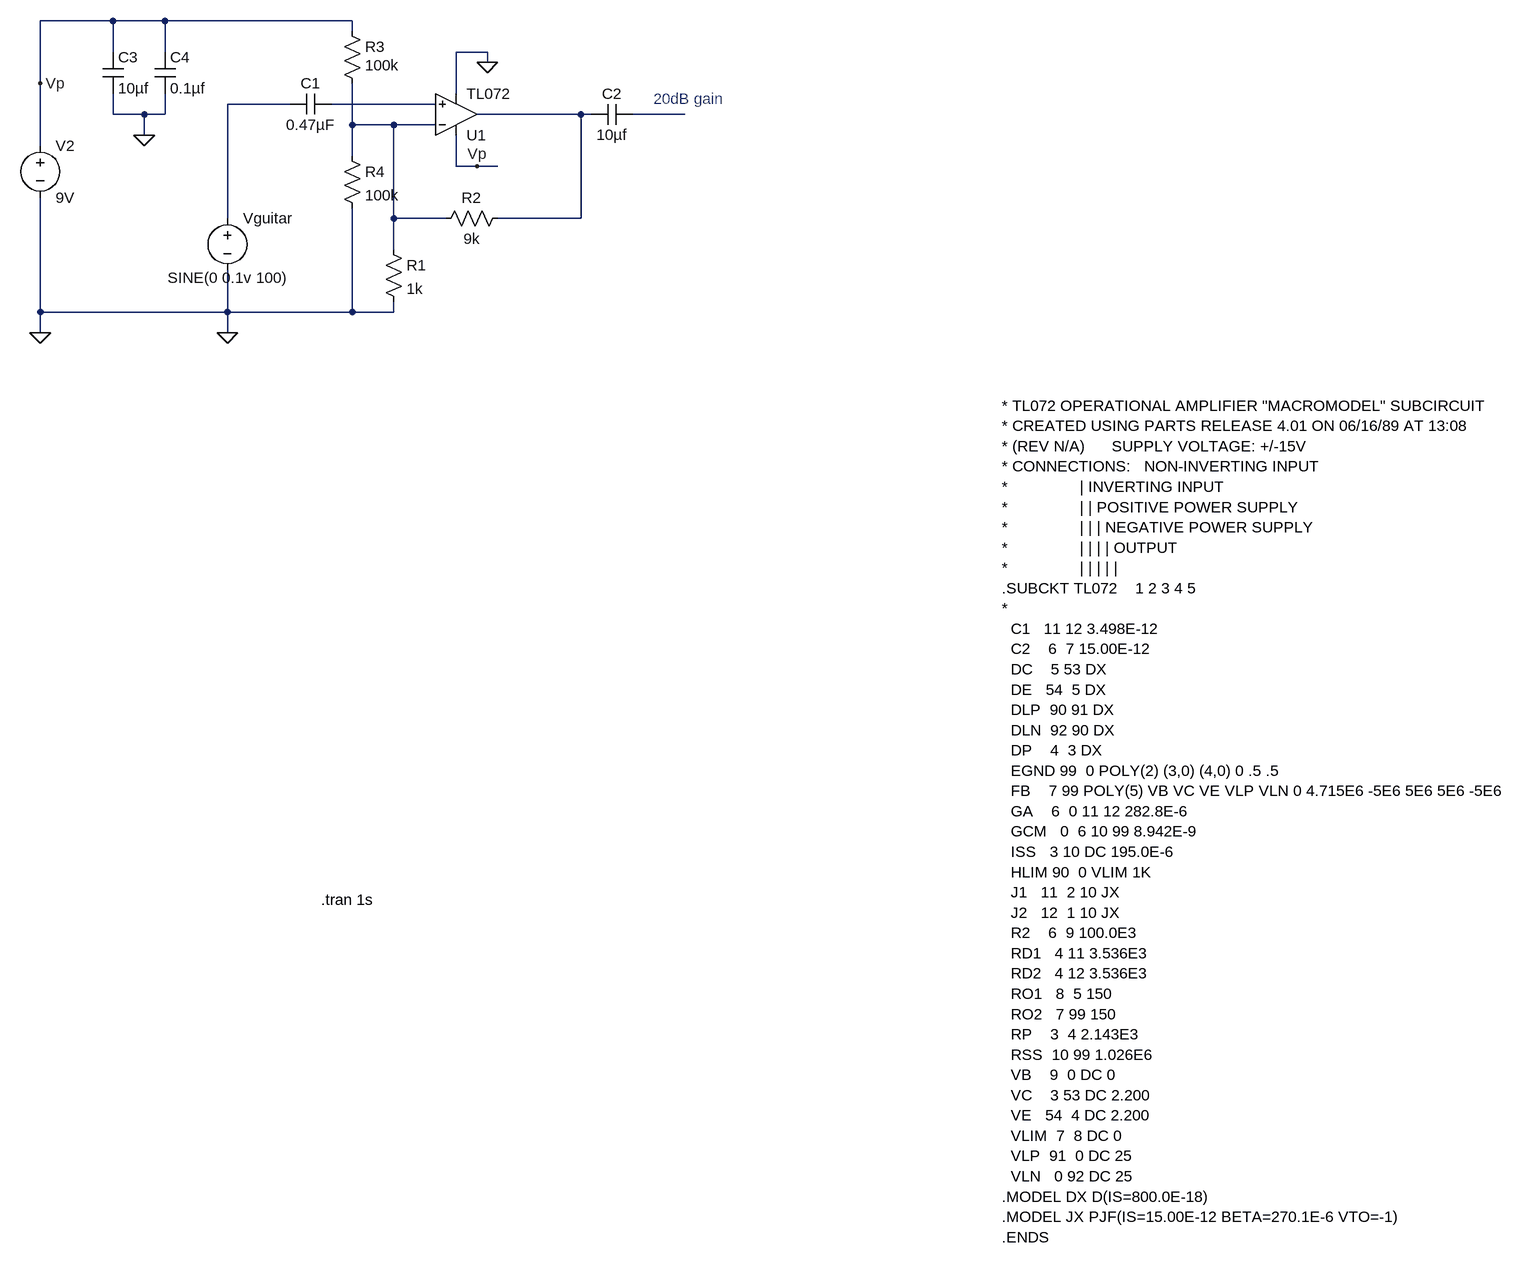
[diagram p0: schematic Preamp_REVA.asc]
Preamp_REVA.asc, the LTspice schematic file:
Version 4.1
SHEET 1 2320 1788
WIRE -464 32 -576 32
WIRE -384 32 -464 32
WIRE -96 32 -384 32
WIRE -96 48 -96 32
WIRE -464 80 -464 32
WIRE -384 80 -384 32
WIRE 112 80 64 80
WIRE 112 96 112 80
WIRE -576 128 -576 32
WIRE 64 144 64 80
WIRE -192 160 -288 160
WIRE 32 160 -128 160
WIRE -464 176 -464 144
WIRE -416 176 -464 176
WIRE -384 176 -384 144
WIRE -384 176 -416 176
WIRE 256 176 96 176
WIRE 272 176 256 176
WIRE 416 176 336 176
WIRE -96 192 -96 128
WIRE -32 192 -96 192
WIRE 32 192 -32 192
WIRE -416 208 -416 176
WIRE -576 224 -576 128
WIRE -96 240 -96 192
WIRE 64 256 64 208
WIRE 96 256 64 256
WIRE 128 256 96 256
WIRE -288 336 -288 160
WIRE -32 336 -32 192
WIRE 48 336 -32 336
WIRE 256 336 256 176
WIRE 256 336 128 336
WIRE -32 384 -32 336
WIRE -576 480 -576 304
WIRE -288 480 -288 416
WIRE -288 480 -576 480
WIRE -96 480 -96 320
WIRE -96 480 -288 480
WIRE -32 480 -32 464
WIRE -32 480 -96 480
WIRE -576 512 -576 480
WIRE -288 512 -288 480
FLAG -576 128 Vp
FLAG -288 512 0
FLAG -576 512 0
FLAG 96 256 Vp
FLAG 112 96 0
FLAG -416 208 0
SYMBOL OpAmps\\opamp2 64 240 M180
SYMATTR InstName U1
SYMATTR Value TL072
SYMBOL res 144 320 R90
WINDOW 0 0 56 VBottom 2
WINDOW 3 32 56 VTop 2
SYMATTR InstName R2
SYMATTR Value 9k
SYMBOL voltage -288 320 R0
WINDOW 3 93 107 Right 2
WINDOW 123 0 0 Left 0
WINDOW 39 0 0 Left 0
SYMATTR Value SINE(0 0.1v 100)
SYMATTR InstName Vguitar
SYMBOL voltage -576 208 R0
SYMATTR InstName V2
SYMATTR Value 9V
SYMBOL cap -128 144 R90
WINDOW 0 0 32 VBottom 2
WINDOW 3 32 32 VTop 2
SYMATTR InstName C1
SYMATTR Value 0.47µF
SYMBOL res -112 32 R0
WINDOW 3 36 68 Left 2
SYMATTR InstName R3
SYMATTR Value 100k
SYMBOL res -112 224 R0
SYMATTR InstName R4
SYMATTR Value 100k
SYMBOL res -48 368 R0
SYMATTR InstName R1
SYMATTR Value 1k
SYMBOL cap 336 160 R90
WINDOW 0 0 32 VBottom 2
WINDOW 3 32 32 VTop 2
SYMATTR InstName C2
SYMATTR Value 10µf
SYMBOL cap -480 80 R0
SYMATTR InstName C3
SYMATTR Value 10µf
SYMBOL cap -400 80 R0
SYMATTR InstName C4
SYMATTR Value 0.1µf
TEXT -144 1384 Left 2 !.tran 1s
TEXT 904 624 Left 2 !* TL072 OPERATIONAL AMPLIFIER "MACROMODEL" SUBCIRCUIT\n* CREATED USING PARTS RELEASE 4.01 ON 06/16/89 AT 13:08\n* (REV N/A)      SUPPLY VOLTAGE: +/-15V\n* CONNECTIONS:   NON-INVERTING INPUT\n*                | INVERTING INPUT\n*                | | POSITIVE POWER SUPPLY\n*                | | | NEGATIVE POWER SUPPLY\n*                | | | | OUTPUT\n*                | | | | |\n.SUBCKT TL072    1 2 3 4 5\n*\n  C1   11 12 3.498E-12\n  C2    6  7 15.00E-12\n  DC    5 53 DX\n  DE   54  5 DX\n  DLP  90 91 DX\n  DLN  92 90 DX\n  DP    4  3 DX\n  EGND 99  0 POLY(2) (3,0) (4,0) 0 .5 .5\n  FB    7 99 POLY(5) VB VC VE VLP VLN 0 4.715E6 -5E6 5E6 5E6 -5E6\n  GA    6  0 11 12 282.8E-6\n  GCM   0  6 10 99 8.942E-9\n  ISS   3 10 DC 195.0E-6\n  HLIM 90  0 VLIM 1K\n  J1   11  2 10 JX\n  J2   12  1 10 JX\n  R2    6  9 100.0E3\n  RD1   4 11 3.536E3\n  RD2   4 12 3.536E3\n  RO1   8  5 150\n  RO2   7 99 150\n  RP    3  4 2.143E3\n  RSS  10 99 1.026E6\n  VB    9  0 DC 0\n  VC    3 53 DC 2.200\n  VE   54  4 DC 2.200\n  VLIM  7  8 DC 0\n  VLP  91  0 DC 25\n  VLN   0 92 DC 25\n.MODEL DX D(IS=800.0E-18)\n.MODEL JX PJF(IS=15.00E-12 BETA=270.1E-6 VTO=-1)\n.ENDS
TEXT 368 152 Left 2 ;20dB gain

The netlist it stands for:
* Preamp_REVA.asc
X§U1 N002 N005 Vp 0 N003 TL072  ; pins In+ In- V+ V- OUT
R2 N003 N005 9k
Vguitar N001 0 SINE(0 0.1v 100)
V2 Vp 0 9V
C1 N002 N001 0.47µF
R3 Vp N005 100k
R4 N005 0 100k
R1 N005 0 1k
C2 N004 N003 10µf
C3 Vp 0 10µf
C4 Vp 0 0.1µf
.tran 1s
* TL072 OPERATIONAL AMPLIFIER "MACROMODEL" SUBCIRCUIT
* CREATED USING PARTS RELEASE 4.01 ON 06/16/89 AT 13:08
* (REV N/A)      SUPPLY VOLTAGE: +/-15V
* CONNECTIONS:   NON-INVERTING INPUT
*                | INVERTING INPUT
*                | | POSITIVE POWER SUPPLY
*                | | | NEGATIVE POWER SUPPLY
*                | | | | OUTPUT
*                | | | | |
.SUBCKT TL072    1 2 3 4 5
*
  C1   11 12 3.498E-12
  C2    6  7 15.00E-12
  DC    5 53 DX
  DE   54  5 DX
  DLP  90 91 DX
  DLN  92 90 DX
  DP    4  3 DX
  EGND 99  0 POLY(2) (3,0) (4,0) 0 .5 .5
  FB    7 99 POLY(5) VB VC VE VLP VLN 0 4.715E6 -5E6 5E6 5E6 -5E6
  GA    6  0 11 12 282.8E-6
  GCM   0  6 10 99 8.942E-9
  ISS   3 10 DC 195.0E-6
  HLIM 90  0 VLIM 1K
  J1   11  2 10 JX
  J2   12  1 10 JX
  R2    6  9 100.0E3
  RD1   4 11 3.536E3
  RD2   4 12 3.536E3
  RO1   8  5 150
  RO2   7 99 150
  RP    3  4 2.143E3
  RSS  10 99 1.026E6
  VB    9  0 DC 0
  VC    3 53 DC 2.200
  VE   54  4 DC 2.200
  VLIM  7  8 DC 0
  VLP  91  0 DC 25
  VLN   0 92 DC 25
.MODEL DX D(IS=800.0E-18)
.MODEL JX PJF(IS=15.00E-12 BETA=270.1E-6 VTO=-1)
.ENDS
* 20dB gain
.backanno
.end